# Altium schematic sheet MIDI_ID.SchDoc
size A4
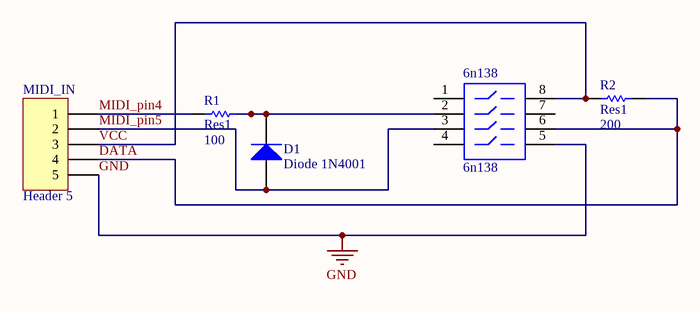
[diagram p0: MIDI_ID.SchDoc]

## Parts
6n138  6n138  [DIP-8]
D1  Diode 1N4001  [DO-41]
MIDI_IN  Header 5  [HDR1X5]
R1  Res1  value 100  [AXIAL-0.3]
R2  Res1  value 200  [AXIAL-0.3]

## Nets
GND: 6n138.5 MIDI_IN.5
DATA: 6n138.6 MIDI_IN.4 R2.2
MIDI_pin4: MIDI_IN.1 R1.1
MIDI_pin5: 6n138.3 D1.1(A) MIDI_IN.2
VCC: 6n138.8 MIDI_IN.3 R2.1
Net6n138_2: 6n138.2 D1.2(K) R1.2

Not connected (* = marked no-connect by the designer): 6n138 1 4 7

## Library data of the parts
6n138 = SW-DIP4: Published: 24-Mar-1999; LatestRevisionDate: 17-Jul-2002; LatestRevisionNote: Re-released for DXP Platform.; PackageReference: DIP-8; Publisher: Altium Limited
D1 = Diode 1N4001: 1 Amp General Purpose Rectifier; Published: 8-Jun-2000; LatestRevisionDate: 17-Jul-2002; LatestRevisionNote: Re-released for DXP Platform.; DatasheetVersion: 1998; PackageVersion: Aug-1999; PackageReference: DO-41; Publisher: Altium Limited; PackageDescription: Diode, Axial; Body 5.2 x 2.7 mm (LxDia. max), Lead Dia. 0.86 mm (max); Code_JEDEC: DO-204-AL; ComponentLink1Description: Manufacturer Link; ComponentLink1URL: http://www.fairchildsemi.com/; ComponentLink2Description: Datasheet; ComponentLink2URL: http://www.fairchildsemi.com/ds/1N%2F1N4001.pdf
MIDI_IN = Header 5: Header, 5-Pin; LatestRevisionDate: 17-Jul-2002; LatestRevisionNote: Re-released for DXP Platform.; Publisher: Altium Limited
R1 R2 = Res1: Resistor; Published: 8-Jun-2000; LatestRevisionDate: 17-Jul-2002; LatestRevisionNote: Re-released for DXP Platform.; PackageReference: AXIAL-0.3; Publisher: Altium Limited; PackageDescription: Axial Device, Thru-Hole; 2 Leads; 0.3 in Pin Spacing